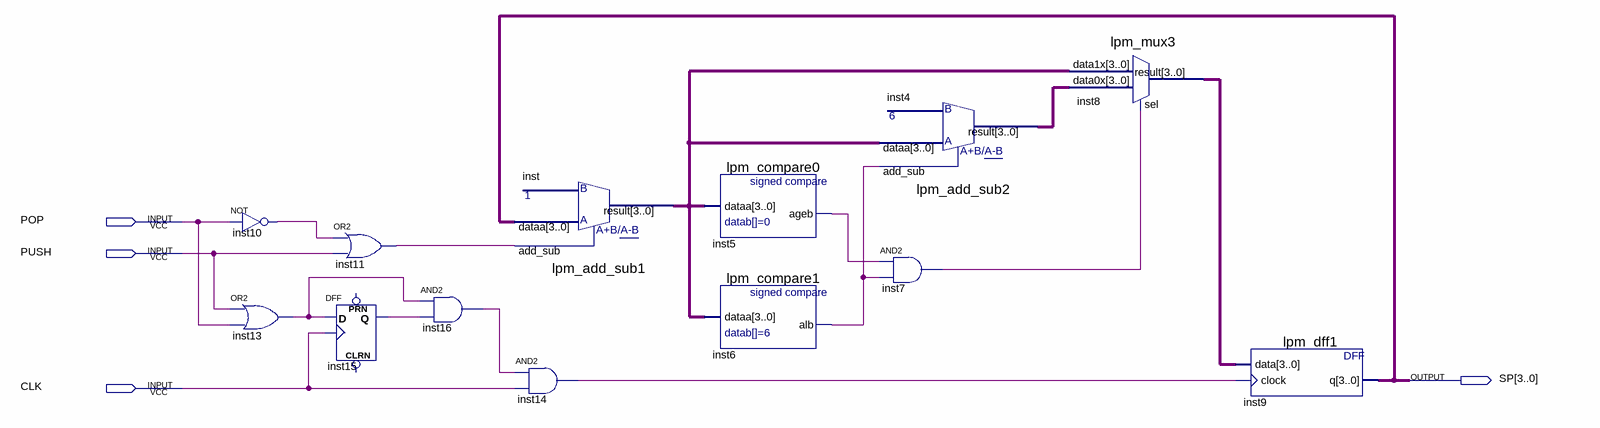
[diagram p0: schematic sheet]
// Quartus schematic STACK_POINTER.bdf as structural Verilog: 13 symbols, 4 pins
module STACK_POINTER (
  input  POP,
  input  PUSH,
  input  CLK,
  output [3:0] SP
);

  wire inst5_ageb, inst6_alb, inst7_out, inst10_out, inst11_out, inst13_out, inst14_out, inst15_q, inst16_out;
  wire [3:0] inst4_result, inst8_result, inst_result;

  not inst10 (inst10_out, POP);
  or inst13 (inst13_out, PUSH, POP);
  or inst11 (inst11_out, inst10_out, PUSH);
  DFF inst15 (.CLK(CLK), .D(inst13_out), .Q(inst15_q));  // open: CLRN, PRN
  and inst16 (inst16_out, inst13_out, inst15_q);
  lpm_add_sub1 inst (.dataa(SP), .add_sub(inst11_out), .result(inst_result));
  and inst14 (inst14_out, inst16_out, CLK);
  lpm_compare0 inst5 (.dataa(inst_result), .ageb(inst5_ageb));
  lpm_compare1 inst6 (.dataa(inst_result), .alb(inst6_alb));
  lpm_add_sub2 inst4 (.dataa(inst_result), .add_sub(inst6_alb), .result(inst4_result));
  and inst7 (inst7_out, inst5_ageb, inst6_alb);
  lpm_mux3 inst8 (.data1x(inst_result), .data0x(inst4_result), .sel(inst7_out), .result(inst8_result));
  lpm_dff1 inst9 (.data(inst8_result), .clock(inst14_out), .q(SP));
endmodule
